# Altium project PCB-Tester-Board-V1.PrjPcb (part 2 of 3)

## Sheet ADC.SchDoc
size A4; DateDraw: Date Draw; DateChecked: Date Review; Workspace: Workspace; TitleTyp: Title-Typ; PageSetup: Record=PageOptions|CenterHorizontal=True|CenterVertical=True|PrintScale=0.97|XCorrection=1.00|YCorrection=1.00|PrintKind=0|BorderSize=5000000|LeftOffset=0|BottomOffset=0|Orientation=2|PaperLength=1000|PaperWidth=1000|Scale=100|PaperSource=7|PrintQuality=-3|MediaType=1|DitherType=10|PrintScaleMode=1|PaperKind=A4|PaperIndex=9
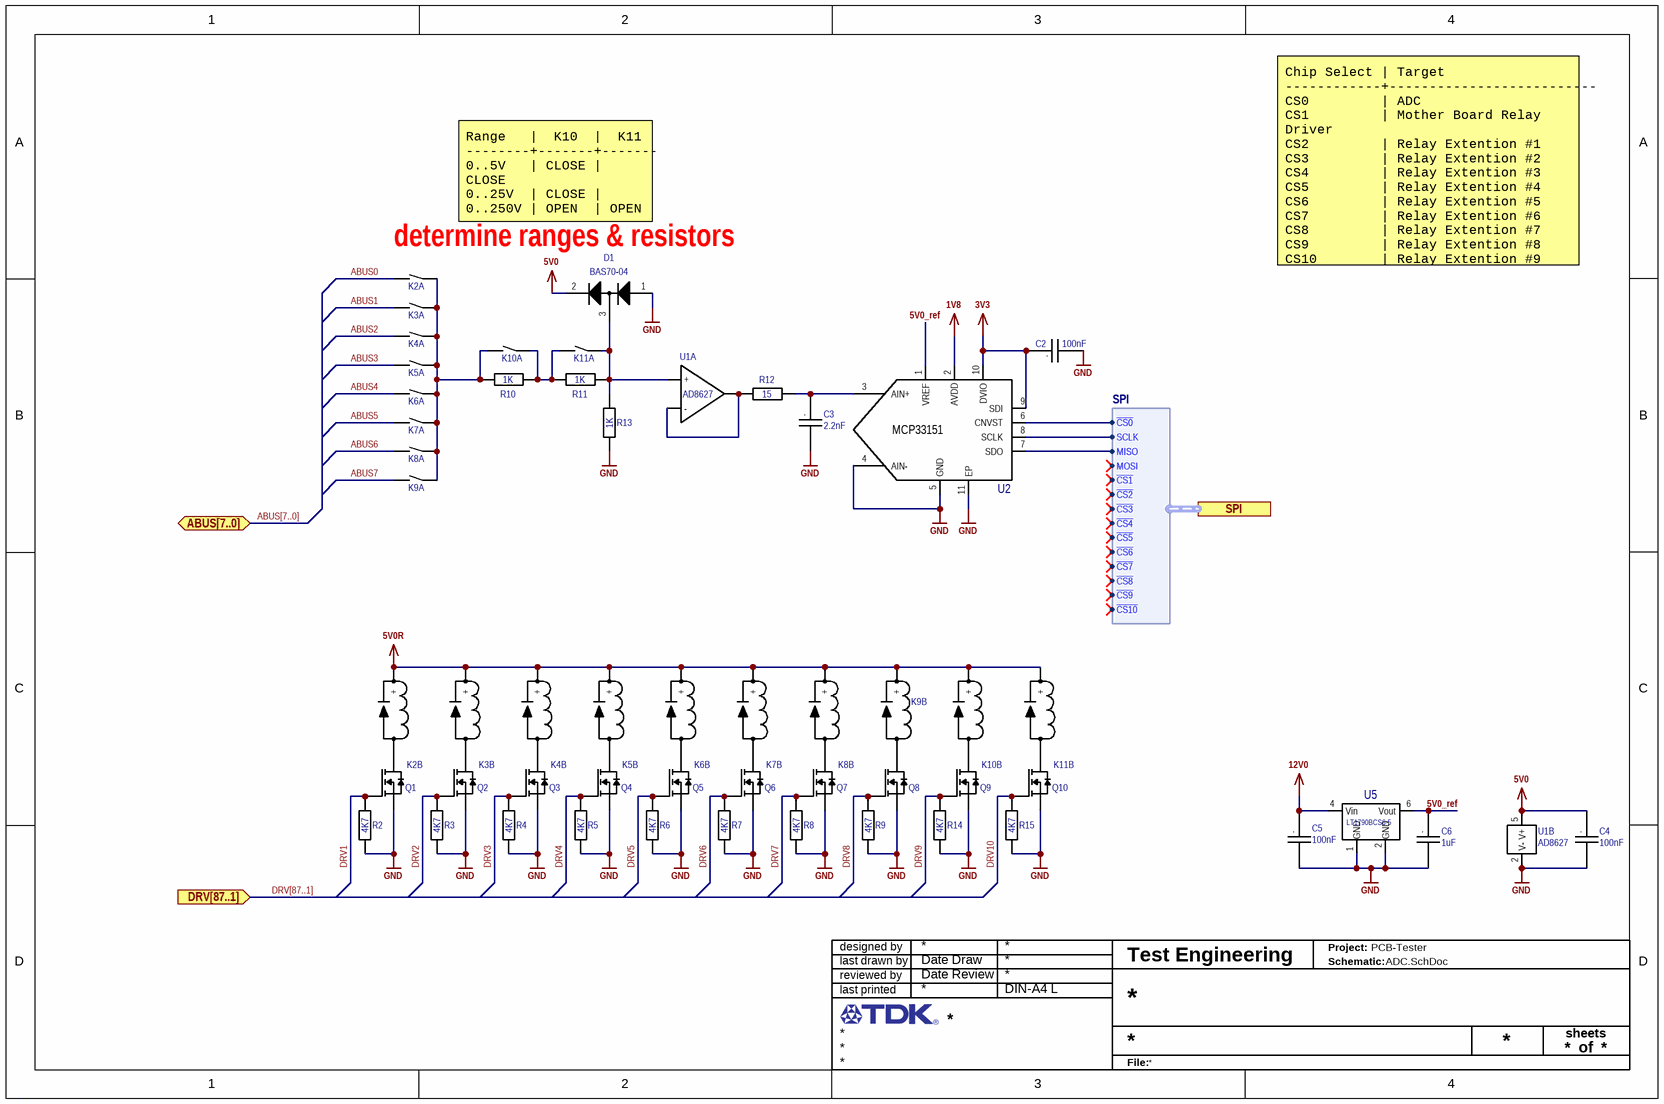
[diagram p5: ADC.SchDoc]

### Parts
C2  value 100nF  [C0402 Reflow]  (hidden comment: C)
C3  value 2.2nF  [C0402 Reflow]  (hidden comment: C)
C4  value 100nF  [C0402 Reflow]  (hidden comment: C)
C5  value 100nF  [C0402 Reflow]  (hidden comment: C)
C6  value 1uF  [C0402 Reflow]  (hidden comment: C)
D1  D  [SOT23-3]  (value not drawn)
K2  K  [118-1A]  (value not drawn)  (parts A,B of 2)
K3  K  [118-1A]  (value not drawn)  (parts A,B of 2)
K4  K  [118-1A]  (value not drawn)  (parts A,B of 2)
K5  K  [118-1A]  (value not drawn)  (parts A,B of 2)
K6  K  [118-1A]  (value not drawn)  (parts A,B of 2)
K7  K  [118-1A]  (value not drawn)  (parts A,B of 2)
K8  K  [118-1A]  (value not drawn)  (parts A,B of 2)
K9  K  [118-1A]  (value not drawn)  (parts A,B of 2)
K10  K  [118-1A]  (value not drawn)  (parts A,B of 2)
K11  K  [118-1A]  (value not drawn)  (parts A,B of 2)
Q1  Q  [SOT23-3]  (value not drawn)
Q2  Q  [SOT23-3]  (value not drawn)
Q3  Q  [SOT23-3]  (value not drawn)
Q4  Q  [SOT23-3]  (value not drawn)
Q5  Q  [SOT23-3]  (value not drawn)
Q6  Q  [SOT23-3]  (value not drawn)
Q7  Q  [SOT23-3]  (value not drawn)
Q8  Q  [SOT23-3]  (value not drawn)
Q9  Q  [SOT23-3]  (value not drawn)
Q10  Q  [SOT23-3]  (value not drawn)
R2  value 4K7  [R0402 Reflow]  (hidden comment: R)
R3  value 4K7  [R0402 Reflow]  (hidden comment: R)
R4  value 4K7  [R0402 Reflow]  (hidden comment: R)
R5  value 4K7  [R0402 Reflow]  (hidden comment: R)
R6  value 4K7  [R0402 Reflow]  (hidden comment: R)
R7  value 4K7  [R0402 Reflow]  (hidden comment: R)
R8  value 4K7  [R0402 Reflow]  (hidden comment: R)
R9  value 4K7  [R0402 Reflow]  (hidden comment: R)
R10  value 1K  [R0201 Reflow]  (hidden comment: R)
R11  value 1K  [R0201 Reflow]  (hidden comment: R)
R12  value 15  [R0402 Reflow]  (hidden comment: R)
R13  value 1K  [R0201 Reflow]  (hidden comment: R)
R14  value 4K7  [R0402 Reflow]  (hidden comment: R)
R15  value 4K7  [R0402 Reflow]  (hidden comment: R)
U1  U  [SC70-5]  (value not drawn)  (parts A,B of 2)
U2  NicName: MCP33151  [TDFN10EP]  (hidden comment: U)
U5  U  [TSOT23-6(S6)]  (value not drawn)

### Ports
ABUS[7..0] (bidir), DRV[87..1] (in), SPI (harness SPI)

### Harnesses
SPI: MISO, MOSI, SCLK, ~{CS0}, ~{CS1}, ~{CS2}, ~{CS3}, ~{CS4}, ~{CS5}, ~{CS6}, ~{CS7}, ~{CS8}, ~{CS9}, ~{CS10}

### Nets
1V8: U2.2(AVDD)
3V3: C2.1 U2.9(SDI) U2.10(DVIO)
5V0: C4.1 D1.2 U1.5(V+)
5V0R: K2.1(+) K3.1(+) K4.1(+) K5.1(+) K6.1(+) K7.1(+) K8.1(+) K9.1(+) K10.1(+) K11.1(+)
12V0: C5.1 U5.4(Vin)
GND: C2.2 C3.2 C4.2 C5.2 C6.2 D1.1 Q1.2(S) Q2.2(S) Q3.2(S) Q4.2(S) Q5.2(S) Q6.2(S) Q7.2(S) Q8.2(S) Q9.2(S) Q10.2(S) R2.1 R3.1 R4.1 R5.1 R6.1 R7.1 R8.1 R9.1 R13.1 R14.1 R15.1 U1.2(V-) U2.4(AIN-) U2.5(GND) U2.11(EP) U5.1(GND) U5.2(GND)
5V0_ref: C6.1 U2.1(VREF) U5.6(Vout)
~{CS0}: U2.6(CNVST) ; port SPI.~{CS0}
ABUS0: K2.3(CA)
ABUS1: K3.3(CA)
ABUS2: K4.3(CA)
ABUS3: K5.3(CA)
ABUS4: K6.3(CA)
ABUS5: K7.3(CA)
ABUS6: K8.3(CA)
ABUS7: K9.3(CA)
DRV1: Q1.1(G) R2.2
DRV2: Q2.1(G) R3.2
DRV3: Q3.1(G) R4.2
DRV4: Q4.1(G) R5.2
DRV5: Q5.1(G) R6.2
DRV6: Q6.1(G) R7.2
DRV7: Q7.1(G) R8.2
DRV8: Q8.1(G) R9.2
DRV9: Q9.1(G) R14.2
DRV10: Q10.1(G) R15.2
MISO: U2.7(SDO) ; port SPI.MISO
SCLK: U2.8(SCLK) ; port SPI.SCLK
NetC3_1: C3.1 R12.1 U2.3(AIN+)
NetD1_3: D1.3 K11.4(CB) R11.2 R13.2 U1.3(+)
NetK2_2: K2.2(-) Q1.3(D)
NetK2_4: K2.4(CB) K3.4(CB) K4.4(CB) K5.4(CB) K6.4(CB) K7.4(CB) K8.4(CB) K9.4(CB) K10.3(CA) R10.1
NetK3_2: K3.2(-) Q2.3(D)
NetK4_2: K4.2(-) Q3.3(D)
NetK5_2: K5.2(-) Q4.3(D)
NetK6_2: K6.2(-) Q5.3(D)
NetK7_2: K7.2(-) Q6.3(D)
NetK8_2: K8.2(-) Q7.3(D)
NetK9_2: K9.2(-) Q8.3(D)
NetK10_2: K10.2(-) Q9.3(D)
NetK10_4: K10.4(CB) K11.3(CA) R10.2 R11.1
NetK11_2: K11.2(-) Q10.3(D)
NetR12_2: R12.2 U1.1(Out) U1.4(-)

### Buses and harness runs
bus ABUS[7..0] = port ABUS[7..0]
bus DRV[87..1] = port DRV[87..1]

### Notes on the sheet
- determine ranges & resistors
- Range   |  K10  |  K11
  --------+-------+-------
  0..5V   | CLOSE | CLOSE
  0..25V  | CLOSE |
  0..250V | OPEN  | OPEN
- Chip Select | Target
  ------------+--------------------------
  CS0         | ADC
  CS1         | Mother Board Relay Driver
  CS2         | Relay Extention #1
  CS3         | Relay Extention #2
  CS4         | Relay Extention #3
  CS5         | Relay Extention #4
  CS6         | Relay Extention #5
  CS7         | Relay Extention #6
  CS8         | Relay Extention #7
  CS9         | Relay Extention #8
  CS10        | Relay Extention #9
- designed by
- reviewed by
- last drawn by
- Project:
- Schematic:
- last printed
- DIN-A4 L
- sheets
- of
- File:
- (in symbol C) .

### Library data of the parts
C2 C4 C5 = C: CAP CER 0.1UF 16V X7R 0402; 04. Manufacturer: KEMET; 07. Manufacturer  Part Number: C0402C104J4RACTU; Tolerance: ±5%; 03. Unit Price: 0.45; 13. Created Date/Name: AUG2018/Hören; Voltage Rating: 16V; Type: X7R; ComponentLink1Description: Info; ComponentLink1URL: https://www.digikey.de/product-detail/en/kemet/C0402C104J4RACTU/399-7761-6-ND/3472292; 02. Distributor Part Number: 399-7761-6-ND; 09. Operating Temperature: -55°C ~ 125°C; 11. RoHS: YES; 01. Distributor: DigiKey; ComponentLink2Description: DataSheet; ComponentLink2URL: https://content.kemet.com/datasheets/KEM_C1002_X7R_SMD.pdf; Package: 0402
C3 = C: CAP CER 2200PF 50V X7R 0402; 04. Manufacturer: Samsung Electro-Mechanics; 07. Manufacturer  Part Number: CL05B222JB5NNNC; Tolerance: ±5%; 03. Unit Price: 0.09; 13. Created Date/Name: AUG2018/Hören; Voltage Rating: 50V; Type: X7R; ComponentLink1Description: Info; ComponentLink1URL: https://www.digikey.de/product-detail/en/samsung-electro-mechanics/CL05B222JB5NNNC/1276-1532-6-ND/3892046; 02. Distributor Part Number: 1276-1532-6-ND; 09. Operating Temperature: -55°C ~ 125°C; 11. RoHS: YES; 01. Distributor: DigiKey; ComponentLink2Description: DataSheet; Package: 0402
C6 = C: CAP CER 1UF 6.3V X7R 0402; 04. Manufacturer: Murata Electronics; 07. Manufacturer  Part Number: GRM155R70J105KA12J; Tolerance: ±10%; 03. Unit Price: 0.11; 13. Created Date/Name: AUG2018/Hören; Voltage Rating: 6.3V; Type: X7R; ComponentLink1Description: Info; ComponentLink1URL: https://www.digikey.de/product-detail/en/murata-electronics/GRM155R70J105KA12J/490-13339-6-ND/5973468; 02. Distributor Part Number: 490-13339-6-ND; 09. Operating Temperature: -55°C ~ 125°C; 11. RoHS: YES; 01. Distributor: DigiKey; ComponentLink2Description: DataSheet; Package: 0402
D1 = BAS70-04: DIODE ARRAY SCHOTTKY 70V SOT23-3; 04. Manufacturer: DIODES Inc; 03. Unit Price: 0.22; 05. Quantity: 1; 13. Created Date/Name: AUG 2018 / Hören; ComponentLink1Description: Info; ComponentLink1URL: https://www.digikey.de/products/en?keywords=BAS70-04-FDITR-ND; 01. Distributor: DigiKey; 02. Distributor Part Number: BAS70-04-FDITR-ND; 09. Operating Temperature: -55°C ~ 125°C; 11. RoHS: YES; ComponentLink4Description: DataSheet; ComponentLink4URL: https://www.diodes.com/assets/Datasheets/ds11007.pdf; 07. Manufacturer  Part Number: BAS70-04
K2-K11 = 118-1-A-5/2D: 5V Signal Relais, Normal Open; 04. Manufacturer: Pickering; 03. Unit Price: 2.60; 05. Quantity: 1000; 06. Data Sheet: Pickering_series_118.pdf; 13. Created Date/Name: 20.12.17 S. Kaiser; Coil Resistance: 1500 Ohm; Max Carry Current: 1.2 A; Max Switch Current: 1A; Max Switch Voltage: 200V; Power Rating: 15W; 01. Distributor: Pickering; 02. Distributor Part Number: 118-1-A-5/2D; 07. Manufacturer  Part Number: 118-1-A-5/2D; 09. Operating Temperature: -20°C ~ +85°C; 11. RoHS: 2011/65/EU; ComponentLink1Description: Info; ComponentLink1URL: http://www.pickeringrelay.com/; ComponentLink2Description: DataSheet; ComponentLink2URL: https://www.pickeringrelay.com/products/single-line-sil-series-111-119/single-line-sil-series-118/; Coil Voltage: 5V
Q1-Q10 = FDV303N: as Q77 on sheet Instrument; 01. Distributor: DigiKey; 02. Distributor Part Number: FDV303NDKR-ND; 07. Manufacturer  Part Number: FDV303N; 09. Operating Temperature: -55°C ~ 150°C (TJ); 11. RoHS: YES; ComponentLink1Description: Info; ComponentLink1URL: https://www.digikey.de/product-detail/en/on-semiconductor/FDV303N/FDV303NDKR-ND/1630434; ComponentLink2Description: DataSheet; ComponentLink2URL: https://media.digikey.com/pdf/Data%20Sheets/Fairchild%20PDFs/FDV303N.pdf; Vdss: 25V; Id: 680mA
R2-R11 R13-R15 = R: as R1 on sheet Instrument; ComponentLink1URL: *; ComponentLink1Description: Info; 09. Operating Temperature: -xx..+yy°C; 11. RoHS: ???; ComponentLink2Description: DataSheet; Package: *
R12 = R: RES SMD 15 OHM 1% 1/10W 0402; 04. Manufacturer: Panasonic Electronic Components; 07. Manufacturer  Part Number: ERJ-2RKF15R0X; 03. Unit Price: 0.09; 13. Created Date/Name: AUG2018/Hören; Power Rating: 0.1W; Tolerance: ±1%; ComponentLink1URL: https://www.digikey.de/product-detail/en/panasonic-electronic-components/ERJ-2RKF15R0X/P15.0LDKR-ND/575530; ComponentLink1Description: Info; 02. Distributor Part Number: P15.0LDKR-ND; 09. Operating Temperature: -55°C ~ 155°C; 11. RoHS: YES; 01. Distributor: DigiKey; ComponentLink2Description: DataSheet; ComponentLink2URL: https://industrial.panasonic.com/cdbs/www-data/pdf/RDA0000/AOA0000C304.pdf; Type: Thick Film; Package: 0402
U1 = AD8627: IC OPAMP JFET 5MHZ RRO SC70-5; 04. Manufacturer: Analog Devices Inc.; 07. Manufacturer  Part Number: AD8627AKSZ-R2; 03. Unit Price: 5.15; 13. Created Date/Name: AUG 2018 / Hören; 01. Distributor: DigiKey; 02. Distributor Part Number: AD8627AKSZ-R2DKR-ND; 09. Operating Temperature: -40°C ~ 85°C; 11. RoHS: YES; ComponentLink1Description: Info; ComponentLink1URL: https://www.digikey.de/product-detail/en/analog-devices-inc/AD8627AKSZ-R2/AD8627AKSZ-R2DKR-ND/3878640; ComponentLink2Description: DataSheet; ComponentLink2URL: http://www.analog.com/media/en/technical-documentation/data-sheets/AD8625_8626_8627.pdf; Package: SC70-5; Part: AD8627
U2 = MCP33151-10T-E/MN: 14-BIT 1 MSPS SGL CH SGL-ENDED S; 04. Manufacturer: Microchip Technology; 03. Unit Price: 4.5; 13. Created Date/Name: AUG 2018 / Hören; 01. Distributor: DigiKey; 02. Distributor Part Number: MCP33151-10T-E/MNDKR-ND; 07. Manufacturer  Part Number: MCP33151-10T-E/MN; 11. RoHS: YES; ComponentLink1Description: Info; ComponentLink1URL: https://www.digikey.de/product-detail/en/microchip-technology/MCP33151-10T-E-MN/MCP33151-10T-E-MNDKR-ND/10270414; ComponentLink2Description: DataSheet; ComponentLink2URL: http://ww1.microchip.com/downloads/en/DeviceDoc/MCP33151-XX-Family-Data-Sheet-DS20006220A.pdf; Package: 10-WFDFN Exposed Pad
U5 = LT1790BCS6-5: IC VREF SERIES 5V, 0.1% TSOT-23-6; 04. Manufacturer: Linear Technology/Analog Devices; 07. Manufacturer  Part Number: LT1790BCS6-5#TRMPBF; 03. Unit Price: 2.86; 13. Created Date/Name: AUG 2018 / Hören; 01. Distributor: DigiKey; 02. Distributor Part Number: LT1790BCS6-5#TRMPBFDKR-ND; 09. Operating Temperature: 0°C ~ 70°C (TA); 11. RoHS: YES; ComponentLink1Description: Info; ComponentLink1URL: https://www.digikey.de/product-detail/en/linear-technology-analog-devices/LT1790BCS6-5-TRMPBF/LT1790BCS6-5-TRMPBFDKR-ND/1618066; ComponentLink2Description: DataSheet; ComponentLink2URL: https://www.analog.com/media/en/technical-documentation/data-sheets/1790fc.pdf; NicName: LT1790BCS6-5

## Sheet RelayDriver.SchDoc
size A4 portrait; DateDraw: Date Draw; DateChecked: Date Review; Workspace: Workspace; TitleTyp: Title-Typ; PageSetup: Record=PageOptions|CenterHorizontal=True|CenterVertical=True|PrintScale=0.97|XCorrection=1.00|YCorrection=1.00|PrintKind=0|BorderSize=5000000|LeftOffset=0|BottomOffset=0|Orientation=2|PaperLength=1000|PaperWidth=1000|Scale=100|PaperSource=7|PrintQuality=-3|MediaType=1|DitherType=10|PrintScaleMode=1|PaperKind=A4|PaperIndex=9
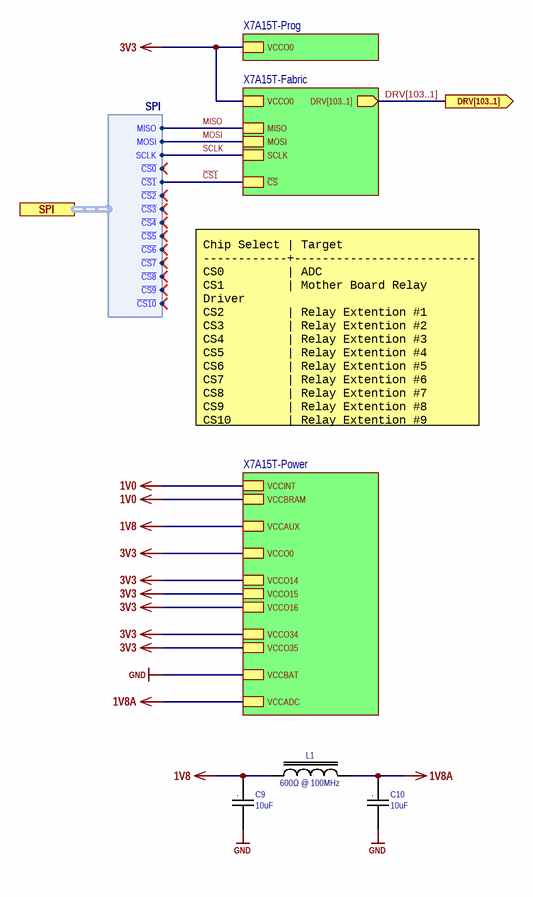
[diagram p6: RelayDriver.SchDoc]

### Parts
C9  value 10uF  [C0805 Reflow]  (hidden comment: C)
C10  value 10uF  [C0805 Reflow]  (hidden comment: C)
L1  Nominal Impedance: 600Ω @ 100MHz  [FB0805]  (hidden comment: L)

### Sub-sheets
X7A15T-Fabric = X7A15T-Fabric.SchDoc: SCLK, MISO, VCCO0, MOSI, ~{CS}, DRV[103..1] (out)
X7A15T-Power = X7A15T-Power.SchDoc (file not in this document): VCCADC, VCCO0, VCCO14, VCCO35, VCCO16, VCCAUX, VCCINT, VCCO34, VCCBRAM, VCCO15, VCCBAT
X7A15T-Prog = X7A15T-Prog.SchDoc: VCCO0

### Ports
DRV[103..1] (out), SPI (harness SPI)

### Harnesses
SPI: MISO, MOSI, SCLK, ~{CS0}, ~{CS1}, ~{CS2}, ~{CS3}, ~{CS4}, ~{CS5}, ~{CS6}, ~{CS7}, ~{CS8}, ~{CS9}, ~{CS10}

### Nets
1V0: sheet X7A15T-Power/VCCINT, sheet X7A15T-Power/VCCBRAM
1V8: C9.1 L1.1 ; sheet X7A15T-Power/VCCAUX
1V8A: C10.1 L1.2 ; sheet X7A15T-Power/VCCADC
3V3: sheet X7A15T-Prog/VCCO0, sheet X7A15T-Fabric/VCCO0, sheet X7A15T-Power/VCCO0, sheet X7A15T-Power/VCCO14, sheet X7A15T-Power/VCCO35, sheet X7A15T-Power/VCCO16, sheet X7A15T-Power/VCCO34, sheet X7A15T-Power/VCCO15
GND: C9.2 C10.2 ; sheet X7A15T-Power/VCCBAT
~{CS1}: sheet X7A15T-Fabric/~{CS}, port SPI.~{CS1}
MISO: sheet X7A15T-Fabric/MISO, port SPI.MISO
MOSI: sheet X7A15T-Fabric/MOSI, port SPI.MOSI
SCLK: sheet X7A15T-Fabric/SCLK, port SPI.SCLK

### Buses and harness runs
bus DRV[103..1] = port DRV[103..1] = sheet X7A15T-Fabric/DRV[103..1]

### Notes on the sheet
- Chip Select | Target
  ------------+--------------------------
  CS0         | ADC
  CS1         | Mother Board Relay Driver
  CS2         | Relay Extention #1
  CS3         | Relay Extention #2
  CS4         | Relay Extention #3
  CS5         | Relay Extention #4
  CS6         | Relay Extention #5
  CS7         | Relay Extention #6
  CS8         | Relay Extention #7
  CS9         | Relay Extention #8
  CS10        | Relay Extention #9
- designed by
- reviewed by
- last drawn by
- Project:
- Schematic:
- last printed
- DIN-A4 P
- sheets
- of
- File:
- (in symbol C) .

### Library data of the parts
C9 C10 = C: CAP CER 10UF 10V X7R 0805; 04. Manufacturer: Samsung Electro-Mechanics; 07. Manufacturer  Part Number: CL21B106KPQNNNE; Tolerance: ±10%; 03. Unit Price: 0.24; 13. Created Date/Name: AUG2018/Hören; Voltage Rating: 10V; Type: X7R; ComponentLink1Description: Info; ComponentLink1URL: https://www.digikey.de/products/en?keywords=1276-1764-6-ND; 02. Distributor Part Number: 1276-1764-6-ND; 09. Operating Temperature: -55°C ~ 125°C; 11. RoHS: YES; 01. Distributor: DigiKey; ComponentLink2Description: DataSheet; Package: 0805
L1 = FB: FERRITE BEAD 600 OHM 0805 1LN; 04. Manufacturer: Würth Elektronik; 07. Manufacturer  Part Number: 742792040; DCR: 150mΩ; Impedance Tolerance: %; 03. Unit Price: 0.22; 13. Created Date/Name: AUG2018/Hören; IRMS: 2A; ComponentLink1Description: Info; ComponentLink1URL: https://www.digikey.de/products/en?keywords=732-1620-6-ND; ComponentLink2Description: DataSheet; ComponentLink2URL: https://www.we-online.de/katalog/datasheet/742792040.pdf; 02. Distributor Part Number: 732-1620-6-ND; 09. Operating Temperature: -55°C ~ 125°C; 11. RoHS: YES; 01. Distributor: DigiKey; ISAT: *; Package: 0805; Tolerance: *; Value: *

## Sheet X7A15T-Prog.SchDoc: =Board +' X7A15T-FPGA1'
size A4; Organization: Test Engineering; Address1: Hans-Bunte-Strasse 19; Address2: D-79108 Freiburg; Address3: Germany; DocumentNumber: U33xxx-S; Revision: V1.0; SheetNumber: 71; SheetTotal: 80; Date: OCT 2018; CheckedBy: ALL; Author: Moerz; CompanyName: TDK-Micronas GmbH; DrawnBy: Moerz; Engineer: Moerz; DateDraw: OCT 2018; DateChecked: N/A; PageSetup: Record=PageOptions|CenterHorizontal=True|CenterVertical=True|PrintScale=0.97|XCorrection=1.00|YCorrection=1.00|PrintKind=0|BorderSize=5000000|LeftOffset=0|BottomOffset=0|Orientation=2|PaperLength=1000|PaperWidth=1000|Scale=100|PaperSource=7|PrintQuality=-3|MediaType=1|DitherType=10|PrintScaleMode=1|PaperKind=A4|PaperIndex=9; TitleTyp: Title-Typ; Block: CPU & SCT8; Workspace: Workspace
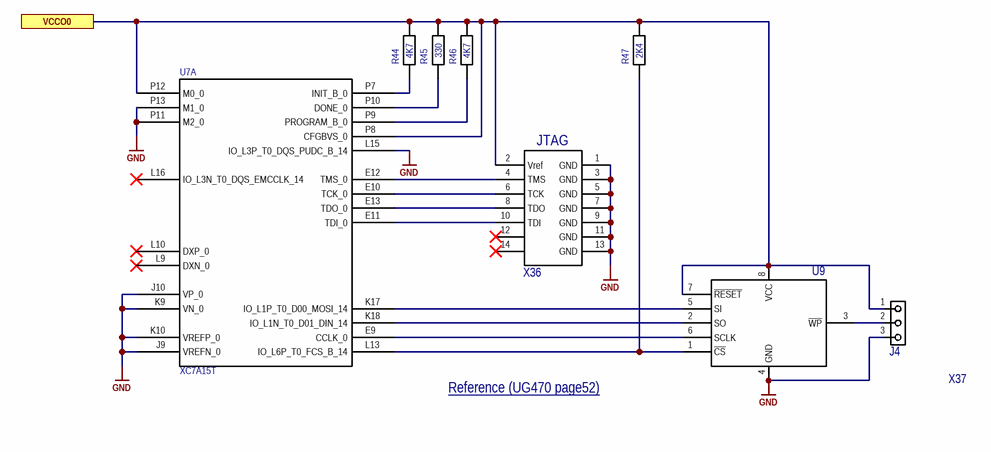
[diagram p7: X7A15T-Prog.SchDoc]

### Parts
J4  J  [Header 100mil 3x1]  (value not drawn)
R44  value 4K7  [R0402 Reflow]  (hidden comment: R)
R45  value 330  [R0402 Reflow]  (hidden comment: R)
R46  value 4K7  [R0402 Reflow]  (hidden comment: R)
R47  value 2K4  [R0402 Reflow]  (hidden comment: R)
U7  NicName: XC7A15T  [XC7A15T-1CSG324C]  (hidden comment: U)  (part A of 8)
U9  U  [SOIC8 (R-8)]  (value not drawn)
X36  NickName: JTAG  [LTMM-107-02-F-D]  (hidden comment: X)
X37  X  (value not drawn)

### Ports
VCCO0

### Nets
3V3: J4.1 R44.2 R45.2 R46.2 R47.2 U7.P8(CFGBVS_0) U7.P12(M0_0) U9.7(~{RESET}) U9.8(VCC) X36.2(Vref) ; port VCCO0
GND: J4.3 U7.J9(VREFN_0) U7.J10(VP_0) U7.K9(VN_0) U7.K10(VREFP_0) U7.L15(IO_L3P_T0_DQS_PUDC_B_14) U7.P11(M2_0) U7.P13(M1_0) U9.4(GND) X36.1(GND) X36.3(GND) X36.5(GND) X36.7(GND) X36.9(GND) X36.11(GND) X36.13(GND)
NetJ4_2: J4.2 U9.3(~{WP})
NetR44_1: R44.1 U7.P7(INIT_B_0)
NetR45_1: R45.1 U7.P10(DONE_0)
NetR46_1: R46.1 U7.P9(PROGRAM_B_0)
NetR47_1: R47.1 U7.L13(IO_L6P_T0_FCS_B_14) U9.1(~{CS})
NetU7_E9: U7.E9(CCLK_0) U9.6(SCLK)
NetU7_E10: U7.E10(TCK_0) X36.6(TCK)
NetU7_E11: U7.E11(TDI_0) X36.10(TDI)
NetU7_E12: U7.E12(TMS_0) X36.4(TMS)
NetU7_E13: U7.E13(TDO_0) X36.8(TDO)
NetU7_K17: U7.K17(IO_L1P_T0_D00_MOSI_14) U9.5(SI)
NetU7_K18: U7.K18(IO_L1N_T0_D01_DIN_14) U9.2(SO)

Not connected (* = marked no-connect by the designer): U7 L9(DXN_0)* L10(DXP_0)* L16(IO_L3N_T0_DQS_EMCCLK_14)*; X36 12* 14*

### Notes on the sheet
- Reference (UG470 page52) <https://www.xilinx.com/support/documentation/user_guides/ug470_7Series_Config.pdf>
- designed by
- reviewed by
- last drawn by
- Project:
- Schematic:
- last printed
- DIN-A4 L
- sheets
- of
- File:

### Library data of the parts
J4 = Header 3Pins 100mil: as J1 on sheet Controller; 01. Distributor: Samtec Inc.; 02. Distributor Part Number: HMTSW-103-07-G-S-240; 11. RoHS: YES; ComponentLink1Description: Info; ComponentLink1URL: https://www.samtec.com/products/hmtsw-103-07-g-s-240; ComponentLink2Description: DataSheet; ComponentLink2URL: http://suddendocs.samtec.com/catalog_english/hmtsw.pdf
R44 R46 = R: RES SMD 4.7K OHM 1% 1/16W 0402; 04. Manufacturer: Yageo; 07. Manufacturer  Part Number: RC0402FR-074K7L; 03. Unit Price: 0.09; 13. Created Date/Name: AUG2018/Hören; Power Rating: 63mW; Tolerance: ±1%; ComponentLink1URL: https://www.digikey.de/products/en?keywords=311-4.7KLRDKR-ND; ComponentLink1Description: Info; 02. Distributor Part Number: 311-4.7KLRDKR-ND; 09. Operating Temperature: -55°C ~ 155°C; 11. RoHS: YES; 01. Distributor: DigiKey; ComponentLink2Description: DataSheet; Type: Thick Film; Package: 0402
R45 = R: RES SMD 330 OHM 1% 1/16W 0402; 04. Manufacturer: Yageo; 07. Manufacturer  Part Number: RC0402FR-07330RL; 03. Unit Price: 0.09; 13. Created Date/Name: AUG2018/Hören; Power Rating: 63mW; Tolerance: ±1%; ComponentLink1URL: https://www.digikey.de/products/en?keywords=311-330LRDKR-ND; ComponentLink1Description: Info; 02. Distributor Part Number: 311-330LRDKR-ND; 09. Operating Temperature: -55°C ~ 155°C; 11. RoHS: YES; 01. Distributor: DigiKey; ComponentLink2Description: DataSheet; Type: Thick Film; Package: 0402
R47 = R: RES SMD 2.4K OHM 1% 1/16W 0402; 04. Manufacturer: Yageo; 07. Manufacturer  Part Number: RC0402FR-072K4L; 03. Unit Price: 0.09; 13. Created Date/Name: AUG2018/Hören; Power Rating: 63mW; Tolerance: ±1%; ComponentLink1URL: *; ComponentLink1Description: Info; 02. Distributor Part Number: 311-2.40KLRDKR-ND; 09. Operating Temperature: -55°C ~ 155°C; 11. RoHS: YES; 01. Distributor: DigiKey; ComponentLink2Description: DataSheet; Type: Thick Film; Package: 0402
U7 = XC7A15T-CS324: XC7A15T-1CSG324C; MFR: XILINX; POPULATED: yes; 03. Unit Price: 20.65; MFR-PN: XC7A15T-CS324; 04. Manufacturer: XILINX; 07. Manufacturer  Part Number: XC7A15T-1CSG324C; 01. Distributor: Avnet; 02. Distributor Part Number: XC7A15T-1CSG324C; 09. Operating Temperature: 0°C ~ 85°C (TJ); 11. RoHS: YES; ComponentLink4Description: Info; ComponentLink4URL: https://www.digikey.de/products/en?keywords=XC7A15T-1CSG324C; ComponentLink5Description: DataSheet; ComponentLink5URL: https://www.xilinx.com/support/documentation/data_sheets/ds181_Artix_7_Data_Sheet.pdf; ComponentLink6Description: NXP; ComponentLink6URL: https://www.nxp.com/part/MK20DN512VMD10
U9 = MX25R3235FM1IH0: IC FLASH 32M SPI 80MHZ 8SOP; 13. Created Date/Name: AUG 2018 / Hören; ComponentLink1Description: Info; ComponentLink1URL: https://www.digikey.de/product-detail/en/macronix/MX25R3235FM1IH0/1092-1175-ND/5957736; ComponentLink2Description: DataSheet; ComponentLink2URL: https://www.macronix.com/Lists/Datasheet/Attachments/7534/MX25R3235F%2c%20Wide%20Range%2c%2032Mb%2c%20v1.6.pdf
X36 = LTMM-107-02-F-D: CONN HEADER VERT 14POS 2MM; 04. Manufacturer: Samtec Inc.; 03. Unit Price: 2.38; 13. Created Date/Name: ??? / Hören; System: Connector; 01. Distributor: DigiKey; 02. Distributor Part Number: LTMM-107-02-F-D-ND; 07. Manufacturer  Part Number: LTMM-107-02-F-D; 11. RoHS: YES; ComponentLink1Description: Info; ComponentLink1URL: https://www.digikey.de/product-detail/en/samtec-inc/LTMM-107-02-F-D/LTMM-107-02-F-D-ND/8723899; ComponentLink2Description: DataSheet; ComponentLink2URL: https://www.samtec.com/products/ltmm
X37 = Jumper: CONN JUMPER SHORTING .100" GOLD; 04. Manufacturer: Sullins Connector Solutions; 07. Manufacturer  Part Number: QPC02SXGN-RC; 03. Unit Price: 0.09; 13. Created Date/Name: AUG2018/Hören; 01. Distributor: DigiKey; 02. Distributor Part Number: S9337-ND; 09. Operating Temperature: -xx..+yy°C; 11. RoHS: ???; ComponentLink1Description: Info; ComponentLink1URL: https://www.digikey.de/product-detail/en/sullins-connector-solutions/QPC02SXGN-RC/S9337-ND/2618262; ComponentLink2Description: DataSheet

## Sheet X7A15T-Fabric.SchDoc: =Board +' X7A15T-FPGA2'
size A3; Organization: Test Engineering; Address1: Hans-Bunte-Strasse 19; Address2: D-79108 Freiburg; Address3: Germany; DocumentNumber: U33xxx-S; Revision: V1.0; SheetNumber: 72; SheetTotal: 80; Date: OCT 2018; CheckedBy: ALL; Author: Moerz; CompanyName: TDK-Micronas GmbH; DrawnBy: Moerz; Engineer: Moerz; DateDraw: OCT 2018; DateChecked: N/A; PageSetup: Record=PageOptions|CenterHorizontal=True|CenterVertical=True|PrintScale=0.97|XCorrection=1.00|YCorrection=1.00|PrintKind=0|BorderSize=5000000|LeftOffset=0|BottomOffset=0|Orientation=2|PaperLength=1000|PaperWidth=1000|Scale=100|PaperSource=7|PrintQuality=-3|MediaType=1|DitherType=10|PrintScaleMode=1|PaperKind=A4|PaperIndex=9; TitleTyp: Title-Typ; Block: CPU & SCT8; Workspace: Workspace
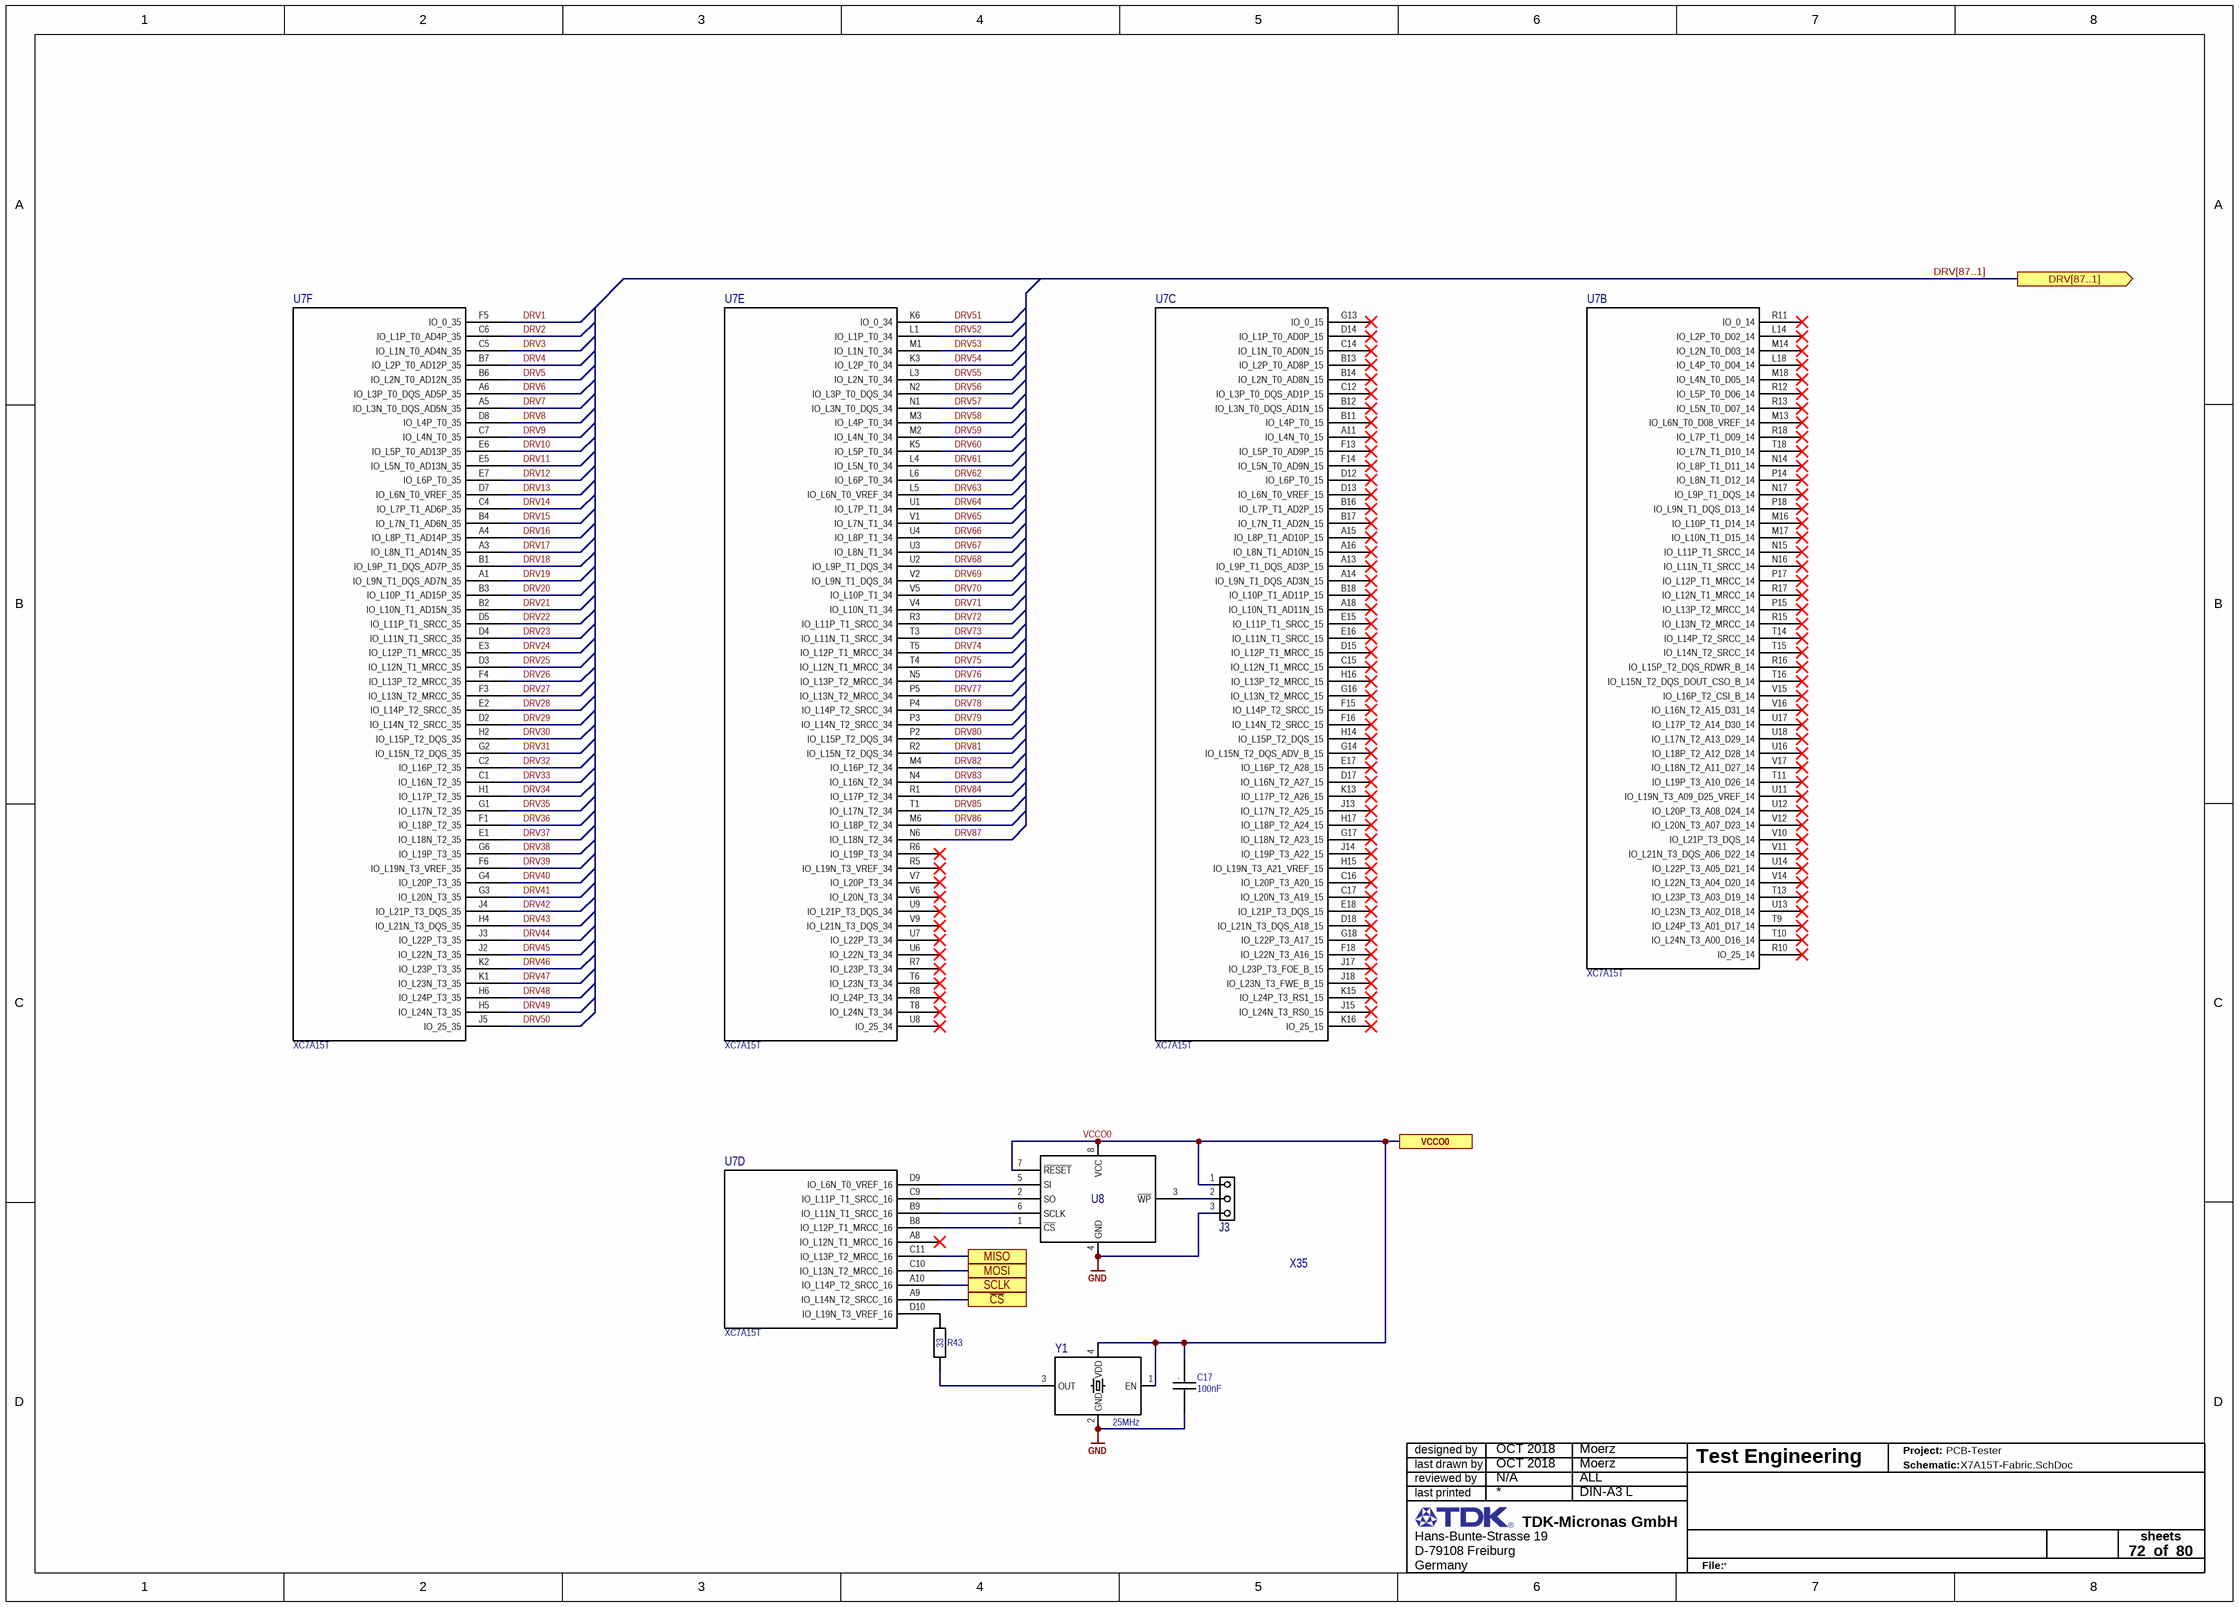
[diagram p8: X7A15T-Fabric.SchDoc]

### Parts
C17  value 100nF  [C0402 Reflow]  (hidden comment: C)
J3  J  [Header 100mil 3x1]  (value not drawn)
R43  value 33  [R0402 Reflow]  (hidden comment: R)
U7  NicName: XC7A15T  [XC7A15T-1CSG324C]  (hidden comment: U)  (parts B,C,D,E,F of 8)
U8  U  [SOIC8 (R-8)]  (value not drawn)
X35  X  (value not drawn)
Y1  Frequency: 25MHz  [4SMD]  (hidden comment: Y)

### Ports
DRV[87..1] (out), MISO, MOSI, SCLK, VCCO0, ~{CS}

### Nets
GND: C17.2 J3.3 U8.4(GND) Y1.2(GND)
VCCO0: C17.1 J3.1 U8.7(~{RESET}) U8.8(VCC) Y1.1(EN) Y1.4(VDD) ; port VCCO0  [project net 3V3]
~{CS1}: U7.A9(IO_L14N_T2_SRCC_16) ; port ~{CS}
DRV1: U7.F5(IO_0_35)  [project net DRV1_72]
DRV2: U7.C6(IO_L1P_T0_AD4P_35)  [project net DRV2_72]
DRV3: U7.C5(IO_L1N_T0_AD4N_35)  [project net DRV3_72]
DRV4: U7.B7(IO_L2P_T0_AD12P_35)  [project net DRV4_72]
DRV5: U7.B6(IO_L2N_T0_AD12N_35)  [project net DRV5_72]
DRV6: U7.A6(IO_L3P_T0_DQS_AD5P_35)  [project net DRV6_72]
DRV7: U7.A5(IO_L3N_T0_DQS_AD5N_35)  [project net DRV7_72]
DRV8: U7.D8(IO_L4P_T0_35)  [project net DRV8_72]
DRV9: U7.C7(IO_L4N_T0_35)  [project net DRV9_72]
DRV10: U7.E6(IO_L5P_T0_AD13P_35)  [project net DRV10_72]
DRV11: U7.E5(IO_L5N_T0_AD13N_35)  [project net DRV11_72]
DRV12: U7.E7(IO_L6P_T0_35)  [project net DRV12_72]
DRV13: U7.D7(IO_L6N_T0_VREF_35)  [project net DRV13_72]
DRV14: U7.C4(IO_L7P_T1_AD6P_35)  [project net DRV14_72]
DRV15: U7.B4(IO_L7N_T1_AD6N_35)  [project net DRV15_72]
DRV16: U7.A4(IO_L8P_T1_AD14P_35)  [project net DRV16_72]
DRV17: U7.A3(IO_L8N_T1_AD14N_35)  [project net DRV17_72]
DRV18: U7.B1(IO_L9P_T1_DQS_AD7P_35)  [project net DRV18_72]
DRV19: U7.A1(IO_L9N_T1_DQS_AD7N_35)  [project net DRV19_72]
DRV20: U7.B3(IO_L10P_T1_AD15P_35)  [project net DRV20_72]
DRV21: U7.B2(IO_L10N_T1_AD15N_35)  [project net DRV21_72]
DRV22: U7.D5(IO_L11P_T1_SRCC_35)  [project net DRV22_72]
DRV23: U7.D4(IO_L11N_T1_SRCC_35)  [project net DRV23_72]
DRV24: U7.E3(IO_L12P_T1_MRCC_35)  [project net DRV24_72]
DRV25: U7.D3(IO_L12N_T1_MRCC_35)  [project net DRV25_72]
DRV26: U7.F4(IO_L13P_T2_MRCC_35)  [project net DRV26_72]
DRV27: U7.F3(IO_L13N_T2_MRCC_35)  [project net DRV27_72]
DRV28: U7.E2(IO_L14P_T2_SRCC_35)  [project net DRV28_72]
DRV29: U7.D2(IO_L14N_T2_SRCC_35)  [project net DRV29_72]
DRV30: U7.H2(IO_L15P_T2_DQS_35)  [project net DRV30_72]
DRV31: U7.G2(IO_L15N_T2_DQS_35)  [project net DRV31_72]
DRV32: U7.C2(IO_L16P_T2_35)  [project net DRV32_72]
DRV33: U7.C1(IO_L16N_T2_35)  [project net DRV33_72]
DRV34: U7.H1(IO_L17P_T2_35)  [project net DRV34_72]
DRV35: U7.G1(IO_L17N_T2_35)  [project net DRV35_72]
DRV36: U7.F1(IO_L18P_T2_35)  [project net DRV36_72]
DRV37: U7.E1(IO_L18N_T2_35)  [project net DRV37_72]
DRV38: U7.G6(IO_L19P_T3_35)  [project net DRV38_72]
DRV39: U7.F6(IO_L19N_T3_VREF_35)  [project net DRV39_72]
DRV40: U7.G4(IO_L20P_T3_35)  [project net DRV40_72]
DRV41: U7.G3(IO_L20N_T3_35)  [project net DRV41_72]
DRV42: U7.J4(IO_L21P_T3_DQS_35)  [project net DRV42_72]
DRV43: U7.H4(IO_L21N_T3_DQS_35)  [project net DRV43_72]
DRV44: U7.J3(IO_L22P_T3_35)  [project net DRV44_72]
DRV45: U7.J2(IO_L22N_T3_35)  [project net DRV45_72]
DRV46: U7.K2(IO_L23P_T3_35)  [project net DRV46_72]
DRV47: U7.K1(IO_L23N_T3_35)  [project net DRV47_72]
DRV48: U7.H6(IO_L24P_T3_35)  [project net DRV48_72]
DRV49: U7.H5(IO_L24N_T3_35)  [project net DRV49_72]
DRV50: U7.J5(IO_25_35)  [project net DRV50_72]
DRV51: U7.K6(IO_0_34)  [project net DRV51_72]
DRV52: U7.L1(IO_L1P_T0_34)  [project net DRV52_72]
DRV53: U7.M1(IO_L1N_T0_34)  [project net DRV53_72]
DRV54: U7.K3(IO_L2P_T0_34)  [project net DRV54_72]
DRV55: U7.L3(IO_L2N_T0_34)  [project net DRV55_72]
DRV56: U7.N2(IO_L3P_T0_DQS_34)  [project net DRV56_72]
DRV57: U7.N1(IO_L3N_T0_DQS_34)  [project net DRV57_72]
DRV58: U7.M3(IO_L4P_T0_34)  [project net DRV58_72]
DRV59: U7.M2(IO_L4N_T0_34)  [project net DRV59_72]
DRV60: U7.K5(IO_L5P_T0_34)  [project net DRV60_72]
DRV61: U7.L4(IO_L5N_T0_34)  [project net DRV61_72]
DRV62: U7.L6(IO_L6P_T0_34)  [project net DRV62_72]
DRV63: U7.L5(IO_L6N_T0_VREF_34)  [project net DRV63_72]
DRV64: U7.U1(IO_L7P_T1_34)  [project net DRV64_72]
DRV65: U7.V1(IO_L7N_T1_34)  [project net DRV65_72]
DRV66: U7.U4(IO_L8P_T1_34)  [project net DRV66_72]
DRV67: U7.U3(IO_L8N_T1_34)  [project net DRV67_72]
DRV68: U7.U2(IO_L9P_T1_DQS_34)  [project net DRV68_72]
DRV69: U7.V2(IO_L9N_T1_DQS_34)  [project net DRV69_72]
DRV70: U7.V5(IO_L10P_T1_34)  [project net DRV70_72]
DRV71: U7.V4(IO_L10N_T1_34)  [project net DRV71_72]
DRV72: U7.R3(IO_L11P_T1_SRCC_34)  [project net DRV72_72]
DRV73: U7.T3(IO_L11N_T1_SRCC_34)  [project net DRV73_72]
DRV74: U7.T5(IO_L12P_T1_MRCC_34)  [project net DRV74_72]
DRV75: U7.T4(IO_L12N_T1_MRCC_34)  [project net DRV75_72]
DRV76: U7.N5(IO_L13P_T2_MRCC_34)  [project net DRV76_72]
DRV77: U7.P5(IO_L13N_T2_MRCC_34)  [project net DRV77_72]
DRV78: U7.P4(IO_L14P_T2_SRCC_34)  [project net DRV78_72]
DRV79: U7.P3(IO_L14N_T2_SRCC_34)  [project net DRV79_72]
DRV80: U7.P2(IO_L15P_T2_DQS_34)  [project net DRV80_72]
DRV81: U7.R2(IO_L15N_T2_DQS_34)  [project net DRV81_72]
DRV82: U7.M4(IO_L16P_T2_34)  [project net DRV82_72]
DRV83: U7.N4(IO_L16N_T2_34)  [project net DRV83_72]
DRV84: U7.R1(IO_L17P_T2_34)  [project net DRV84_72]
DRV85: U7.T1(IO_L17N_T2_34)  [project net DRV85_72]
DRV86: U7.M6(IO_L18P_T2_34)  [project net DRV86_72]
DRV87: U7.N6(IO_L18N_T2_34)  [project net DRV87_72]
MISO: U7.C11(IO_L13P_T2_MRCC_16) ; port MISO
MOSI: U7.C10(IO_L13N_T2_MRCC_16) ; port MOSI
SCLK: U7.A10(IO_L14P_T2_SRCC_16) ; port SCLK
NetJ3_2: J3.2 U8.3(~{WP})
NetR43_1: R43.1 Y1.3(OUT)
NetR43_2: R43.2 U7.D10(IO_L19N_T3_VREF_16)
NetU7_B8: U7.B8(IO_L12P_T1_MRCC_16) U8.1(~{CS})
NetU7_B9: U7.B9(IO_L11N_T1_SRCC_16) U8.6(SCLK)
NetU7_C9: U7.C9(IO_L11P_T1_SRCC_16) U8.2(SO)
NetU7_D9: U7.D9(IO_L6N_T0_VREF_16) U8.5(SI)

Not connected (* = marked no-connect by the designer): U7 A8(IO_L12N_T1_MRCC_16)* A11(IO_L4N_T0_15)* A13(IO_L9P_T1_DQS_AD3P_15)* A14(IO_L9N_T1_DQS_AD3N_15)* A15(IO_L8P_T1_AD10P_15)* A16(IO_L8N_T1_AD10N_15)* A18(IO_L10N_T1_AD11N_15)* B11(IO_L4P_T0_15)* B12(IO_L3N_T0_DQS_AD1N_15)* B13(IO_L2P_T0_AD8P_15)* B14(IO_L2N_T0_AD8N_15)* B16(IO_L7P_T1_AD2P_15)* B17(IO_L7N_T1_AD2N_15)* B18(IO_L10P_T1_AD11P_15)* C12(IO_L3P_T0_DQS_AD1P_15)* C14(IO_L1N_T0_AD0N_15)* C15(IO_L12N_T1_MRCC_15)* C16(IO_L20P_T3_A20_15)* C17(IO_L20N_T3_A19_15)* D12(IO_L6P_T0_15)* D13(IO_L6N_T0_VREF_15)* D14(IO_L1P_T0_AD0P_15)* D15(IO_L12P_T1_MRCC_15)* D17(IO_L16N_T2_A27_15)* D18(IO_L21N_T3_DQS_A18_15)* E15(IO_L11P_T1_SRCC_15)* E16(IO_L11N_T1_SRCC_15)* E17(IO_L16P_T2_A28_15)* E18(IO_L21P_T3_DQS_15)* F13(IO_L5P_T0_AD9P_15)* F14(IO_L5N_T0_AD9N_15)* F15(IO_L14P_T2_SRCC_15)* F16(IO_L14N_T2_SRCC_15)* F18(IO_L22N_T3_A16_15)* G13(IO_0_15)* G14(IO_L15N_T2_DQS_ADV_B_15)* G16(IO_L13N_T2_MRCC_15)* G17(IO_L18N_T2_A23_15)* G18(IO_L22P_T3_A17_15)* H14(IO_L15P_T2_DQS_15)* H15(IO_L19N_T3_A21_VREF_15)* H16(IO_L13P_T2_MRCC_15)* H17(IO_L18P_T2_A24_15)* J13(IO_L17N_T2_A25_15)* J14(IO_L19P_T3_A22_15)* J15(IO_L24N_T3_RS0_15)* J17(IO_L23P_T3_FOE_B_15)* J18(IO_L23N_T3_FWE_B_15)* K13(IO_L17P_T2_A26_15)* K15(IO_L24P_T3_RS1_15)* K16(IO_25_15)* L14(IO_L2P_T0_D02_14)* L18(IO_L4P_T0_D04_14)* M13(IO_L6N_T0_D08_VREF_14)* M14(IO_L2N_T0_D03_14)* M16(IO_L10P_T1_D14_14)* M17(IO_L10N_T1_D15_14)* M18(IO_L4N_T0_D05_14)* N14(IO_L8P_T1_D11_14)* N15(IO_L11P_T1_SRCC_14)* N16(IO_L11N_T1_SRCC_14)* N17(IO_L9P_T1_DQS_14)* P14(IO_L8N_T1_D12_14)* P15(IO_L13P_T2_MRCC_14)* P17(IO_L12P_T1_MRCC_14)* P18(IO_L9N_T1_DQS_D13_14)* R5(IO_L19N_T3_VREF_34)* R6(IO_L19P_T3_34)* R7(IO_L23P_T3_34)* R8(IO_L24P_T3_34)* R10(IO_25_14)* R11(IO_0_14)* R12(IO_L5P_T0_D06_14)* R13(IO_L5N_T0_D07_14)* R15(IO_L13N_T2_MRCC_14)* R16(IO_L15P_T2_DQS_RDWR_B_14)* R17(IO_L12N_T1_MRCC_14)* R18(IO_L7P_T1_D09_14)* T6(IO_L23N_T3_34)* T8(IO_L24N_T3_34)* T9(IO_L24P_T3_A01_D17_14)* T10(IO_L24N_T3_A00_D16_14)* T11(IO_L19P_T3_A10_D26_14)* T13(IO_L23P_T3_A03_D19_14)* T14(IO_L14P_T2_SRCC_14)* T15(IO_L14N_T2_SRCC_14)* T16(IO_L15N_T2_DQS_DOUT_CSO_B_14)* T18(IO_L7N_T1_D10_14)* U6(IO_L22N_T3_34)* U7(IO_L22P_T3_34)* U8(IO_25_34)* U9(IO_L21P_T3_DQS_34)* U11(IO_L19N_T3_A09_D25_VREF_14)* U12(IO_L20P_T3_A08_D24_14)* U13(IO_L23N_T3_A02_D18_14)* U14(IO_L22P_T3_A05_D21_14)* U16(IO_L18P_T2_A12_D28_14)* U17(IO_L17P_T2_A14_D30_14)* U18(IO_L17N_T2_A13_D29_14)* V6(IO_L20N_T3_34)* V7(IO_L20P_T3_34)* V9(IO_L21N_T3_DQS_34)* V10(IO_L21P_T3_DQS_14)* V11(IO_L21N_T3_DQS_A06_D22_14)* V12(IO_L20N_T3_A07_D23_14)* V14(IO_L22N_T3_A04_D20_14)* V15(IO_L16P_T2_CSI_B_14)* V16(IO_L16N_T2_A15_D31_14)* V17(IO_L18N_T2_A11_D27_14)*

### Buses and harness runs
bus DRV[87..1] = port DRV[87..1]

### Notes on the sheet
- designed by
- reviewed by
- last drawn by
- Project:
- Schematic:
- last printed
- DIN-A3 L
- sheets
- of
- File:
- (in symbol C) .

### Library data of the parts
C17 = C: CAP CER 0.1UF 16V X7R 0402; 04. Manufacturer: KEMET; 07. Manufacturer  Part Number: C0402C104J4RACTU; Tolerance: ±5%; 03. Unit Price: 0.45; 13. Created Date/Name: AUG2018/Hören; Voltage Rating: 16V; Type: X7R; ComponentLink1Description: Info; ComponentLink1URL: https://www.digikey.de/product-detail/en/kemet/C0402C104J4RACTU/399-7761-6-ND/3472292; 02. Distributor Part Number: 399-7761-6-ND; 09. Operating Temperature: -55°C ~ 125°C; 11. RoHS: YES; 01. Distributor: DigiKey; ComponentLink2Description: DataSheet; ComponentLink2URL: https://content.kemet.com/datasheets/KEM_C1002_X7R_SMD.pdf; Package: 0402
J3 = Header 3Pins 100mil: CONN HEADER VERT 3POS 2.54MM; 04. Manufacturer: Samtec Inc.; 07. Manufacturer  Part Number: HMTSW-103-07-G-S-240; 03. Unit Price: 0.25; 13. Created Date/Name: AUG2018/Hören; 01. Distributor: Samtec Inc.; 02. Distributor Part Number: HMTSW-103-07-G-S-240; 11. RoHS: YES; ComponentLink1Description: Info; ComponentLink1URL: https://www.samtec.com/products/hmtsw-103-07-g-s-240; ComponentLink2Description: DataSheet; ComponentLink2URL: http://suddendocs.samtec.com/catalog_english/hmtsw.pdf
R43 = R: RES SMD 33 OHM 1% 1/16W 0402; 04. Manufacturer: Yageo; 07. Manufacturer  Part Number: RC0402FR-0733RL; 03. Unit Price: 0.09; 13. Created Date/Name: AUG2018/Hören; Power Rating: 63mW; Tolerance: ±1%; ComponentLink1URL: https://www.digikey.de/products/en?keywords=311-33.0LRDKR-ND; ComponentLink1Description: Info; 02. Distributor Part Number: 311-33.0LRDKR-ND; 09. Operating Temperature: -55°C ~ 155°C; 11. RoHS: YES; 01. Distributor: DigiKey; ComponentLink2Description: DataSheet; Type: Thick Film; Package: 0402
U7 = XC7A15T-CS324: XC7A15T-1CSG324C; MFR: XILINX; POPULATED: yes; 03. Unit Price: 20.65; MFR-PN: XC7A15T-CS324; 04. Manufacturer: XILINX; 07. Manufacturer  Part Number: XC7A15T-1CSG324C; 01. Distributor: Avnet; 02. Distributor Part Number: XC7A15T-1CSG324C; 09. Operating Temperature: 0°C ~ 85°C (TJ); 11. RoHS: YES; ComponentLink4Description: Info; ComponentLink4URL: https://www.digikey.de/products/en?keywords=XC7A15T-1CSG324C; ComponentLink5Description: DataSheet; ComponentLink5URL: https://www.xilinx.com/support/documentation/data_sheets/ds181_Artix_7_Data_Sheet.pdf; ComponentLink6Description: NXP; ComponentLink6URL: https://www.nxp.com/part/MK20DN512VMD10
U8 = MX25R3235FM1IH0: IC FLASH 32M SPI 80MHZ 8SOP; 13. Created Date/Name: AUG 2018 / Hören; ComponentLink1Description: Info; ComponentLink1URL: https://www.digikey.de/product-detail/en/macronix/MX25R3235FM1IH0/1092-1175-ND/5957736; ComponentLink2Description: DataSheet; ComponentLink2URL: https://www.macronix.com/Lists/Datasheet/Attachments/7534/MX25R3235F%2c%20Wide%20Range%2c%2032Mb%2c%20v1.6.pdf
X35 = Jumper: CONN JUMPER SHORTING .100" GOLD; 04. Manufacturer: Sullins Connector Solutions; 07. Manufacturer  Part Number: QPC02SXGN-RC; 03. Unit Price: 0.09; 13. Created Date/Name: AUG2018/Hören; 01. Distributor: DigiKey; 02. Distributor Part Number: S9337-ND; 09. Operating Temperature: -xx..+yy°C; 11. RoHS: ???; ComponentLink1Description: Info; ComponentLink1URL: https://www.digikey.de/product-detail/en/sullins-connector-solutions/QPC02SXGN-RC/S9337-ND/2618262; ComponentLink2Description: DataSheet
Y1 = ASE-25.000MHZ-LC-T: XTAL OSC XO 25.0000MHZ CMOS SMD; 04. Manufacturer: Abracon LLC; 03. Unit Price: 1.46; 13. Created Date/Name: AUG 2018 / Hören; 01. Distributor: DigiKey; 02. Distributor Part Number: 535-9568-1-ND; 07. Manufacturer  Part Number: ASE-25.000MHZ-LC-T; 11. RoHS: YES; ComponentLink1Description: Info; ComponentLink1URL: https://www.digikey.de/products/en?keywords=535-9568-1-ND; ComponentLink2Description: DataSheet; Package: 4SMD

## Sheet Input.SchDoc
size A4; DateDraw: Date Draw; DateChecked: Date Review; Workspace: Workspace; TitleTyp: Title-Typ; PageSetup: Record=PageOptions|CenterHorizontal=True|CenterVertical=True|PrintScale=0.97|XCorrection=1.00|YCorrection=1.00|PrintKind=0|BorderSize=5000000|LeftOffset=0|BottomOffset=0|Orientation=2|PaperLength=1000|PaperWidth=1000|Scale=100|PaperSource=7|PrintQuality=-3|MediaType=1|DitherType=10|PrintScaleMode=1|PaperKind=A4|PaperIndex=9
Used 5 times, as channels Controller/Input, Controller/Input, Controller/Input, Controller/Input, Controller/Input. Parts and nets are listed once, with the designators drawn on the sheet.
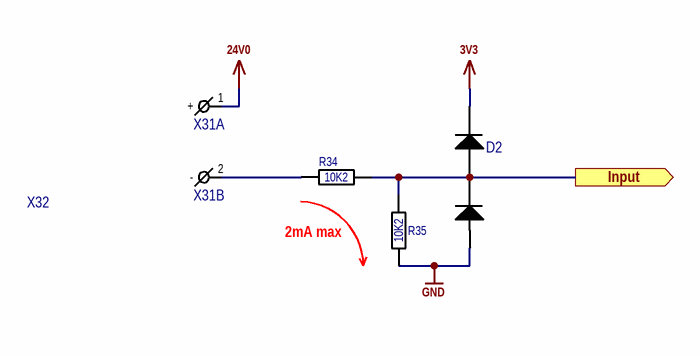
[diagram p9: Input.SchDoc]

### Parts
D2  D  [SOT23-3]  (value not drawn)
R34  value 10K2  [R0603 Reflow]  (hidden comment: R)
R35  value 10K2  [R0603 Reflow]  (hidden comment: R)
X31  X  [691322310002]  (value not drawn)  (parts A,B of 2)
X32  X  [691361300002]  (value not drawn)

### Ports
Input (out)

### Nets
3V3: D2.2(C)
24V0: X31.1(+)
GND: D2.1(A) R35.1
Input: D2.3(C/A) R34.2 R35.2 ; port Input
NetR34_1: R34.1 X31.2(-)

### Channels
Controller/Input: designators end in _Controller_Input#1; ports Input=In1
Controller/Input: designators end in _Controller_Input#2; ports Input=In2
Controller/Input: designators end in _Controller_Input#3; ports Input=In3
Controller/Input: designators end in _Controller_Input#4; ports Input=In4
Controller/Input: designators end in _Controller_Input#5; ports Input=In5

### Notes on the sheet
- 2mA max
- designed by
- reviewed by
- last drawn by
- Project:
- Schematic:
- last printed
- DIN-A4 L
- sheets
- of
- File:

### Library data of the parts
D2 = BAV199L: DIODE ARRAY GP 70V 215MA SOT23-3; 04. Manufacturer: ON Semiconductor; 07. Manufacturer  Part Number: BAV199LT1G; 03. Unit Price: 0.19; 13. Created Date/Name: AUG 2018 / Hören; 01. Distributor: DigiKey; 02. Distributor Part Number: BAV199LT1GOSDKR-ND; 09. Operating Temperature: -65°C ~ 150°C; 11. RoHS: YES; ComponentLink1Description: Info; ComponentLink1URL: https://www.digikey.de/product-detail/en/on-semiconductor/BAV199LT1G/BAV199LT1GOSDKR-ND/1831717; ComponentLink2Description: DataSheet; ComponentLink2URL: http://www.onsemi.com/pub/Collateral/BAV199LT1-D.PDF; NicName: BAV199L; Package: SOT23-3
R34 = R: RES SMD 10.2K OHM 1% 1/10W 0603; 04. Manufacturer: Yageo; 07. Manufacturer  Part Number: RC0603FR-0710K2L; 03. Unit Price: 0.09; 13. Created Date/Name: AUG2018/Hören; Power Rating: 0.1W; Tolerance: ±1%; ComponentLink1URL: *; ComponentLink1Description: Info; 02. Distributor Part Number: 311-10.2KHRDKR-ND; 09. Operating Temperature: -55°C ~ 155°C; 11. RoHS: YES; 01. Distributor: DigiKey; ComponentLink2Description: DataSheet; Type: Thick Film; Package: 0603
R35 = R: RES SMD 1.62K OHM 1% 1/10W 0603; 04. Manufacturer: Yageo; 07. Manufacturer  Part Number: RC0603FR-071K62L; 03. Unit Price: 0.09; 13. Created Date/Name: AUG2018/Hören; Power Rating: 0.1W; Tolerance: ±1%; ComponentLink1URL: *; ComponentLink1Description: Info; 02. Distributor Part Number: 311-1.62KHRDKR-ND; 09. Operating Temperature: -55°C ~ 155°C; 11. RoHS: YES; 01. Distributor: DigiKey; ComponentLink2Description: DataSheet; Type: Thick Film; Package: 0603
X31 = 691322310002: TERM BLOCK HDR 2POS 90DEG 3.81MM; 04. Manufacturer: Würth Elektronik; 03. Unit Price: 0.32; 13. Created Date/Name: ??? / Hören; System: Connector; 01. Distributor: DigiKey; 02. Distributor Part Number: 732-2088-ND; 07. Manufacturer  Part Number: 691322310002; 11. RoHS: YES; ComponentLink1Description: Info; ComponentLink1URL: https://www.digikey.de/products/en?keywords=691322310002; ComponentLink2Description: DataSheet; ComponentLink2URL: https://media.digikey.com/pdf/Data%20Sheets/Wurth%20Electronics%20PDFs/Terminal%20Blocks%20WR-TBL.pdf
X32 = 691361300002: TERM BLOCK PLUG 2POS STR 3.81MM; 13. Created Date/Name: ??? / Hören; System: Connector; ComponentLink1Description: Info; ComponentLink1URL: https://www.digikey.de/products/en?keywords=691361300002; ComponentLink2Description: DataSheet; ComponentLink2URL: https://media.digikey.com/pdf/Data%20Sheets/Wurth%20Electronics%20PDFs/Terminal%20Blocks%20WR-TBL.pdf

## Sheet Output.SchDoc
size A4; DateDraw: Date Draw; DateChecked: Date Review; Workspace: Workspace; TitleTyp: Title-Typ; PageSetup: Record=PageOptions|CenterHorizontal=True|CenterVertical=True|PrintScale=0.97|XCorrection=1.00|YCorrection=1.00|PrintKind=0|BorderSize=5000000|LeftOffset=0|BottomOffset=0|Orientation=2|PaperLength=1000|PaperWidth=1000|Scale=100|PaperSource=7|PrintQuality=-3|MediaType=1|DitherType=10|PrintScaleMode=1|PaperKind=A4|PaperIndex=9
Used 5 times, as channels Controller/Output, Controller/Output, Controller/Output, Controller/Output, Controller/Output. Parts and nets are listed once, with the designators drawn on the sheet.
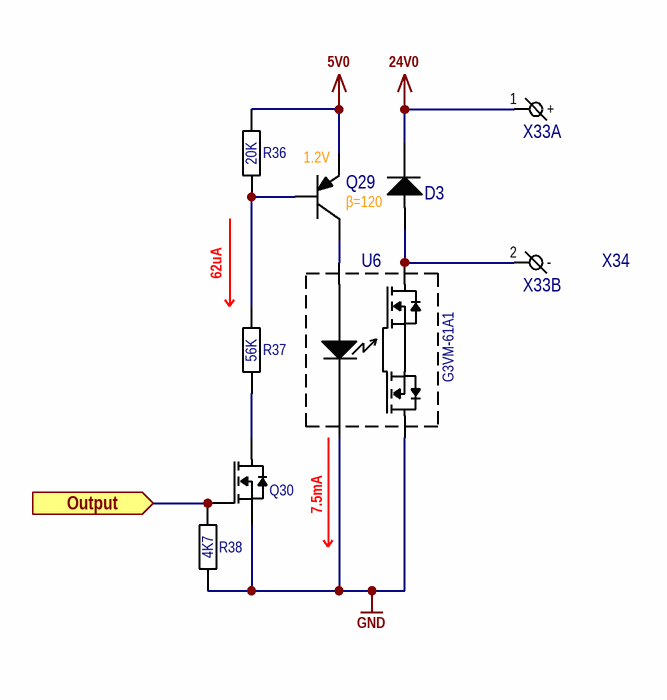
[diagram p10: Output.SchDoc]

### Parts
D3  D  [SOT23-3]  (value not drawn)
Q29  HFE: β=120  [SOT23-3]  (hidden comment: Q)
Q30  Q  [SOT23-3]  (value not drawn)
R36  value 20K  [R0201 Reflow]  (hidden comment: R)
R37  value 56K  [R0603 Reflow]  (hidden comment: R)
R38  value 4K7  [R0402 Reflow]  (hidden comment: R)
U6  U  [4DIP]  (value not drawn)
X33  X  [691322310002]  (value not drawn)  (parts A,B of 2)
X34  X  [691361300002]  (value not drawn)

### Ports
Output (in)

### Nets
5V0: Q29.2(E) R36.2
24V0: D3.3(C) X33.1(+)
GND: Q30.2(S) R38.1 U6.2(C) U6.3(D)
Output: Q30.1(G) R38.2 ; port Output
NetD3_1: D3.1(A) U6.4(D) X33.2(-)
NetQ29_1: Q29.1(B) R36.1 R37.2
NetQ29_3: Q29.3(C) U6.1(A)
NetQ30_3: Q30.3(D) R37.1

### Channels
Controller/Output: designators end in _Controller_Output#1; ports Output=DRV11
Controller/Output: designators end in _Controller_Output#2; ports Output=DRV12
Controller/Output: designators end in _Controller_Output#3; ports Output=DRV13
Controller/Output: designators end in _Controller_Output#4; ports Output=DRV14
Controller/Output: designators end in _Controller_Output#5; ports Output=DRV15

### Notes on the sheet
- (near Q29) 1.2V
- 62uA
- 7.5mA
- designed by
- reviewed by
- last drawn by
- Project:
- Schematic:
- last printed
- DIN-A4 L
- sheets
- of
- File:

### Library data of the parts
D3 = HSMS-2800-TR1G: RF DIODE SCHOTTKY 70V SOT23-3; 13. Created Date/Name: AUG 2018 / Hören; ComponentLink1Description: Info; ComponentLink1URL: https://www.digikey.de/products/en/discrete-semiconductor-products/diodes-rf/284?k=HSMS-2800&k=&pkeyword=HSMS-2800&sv=0&pv7=243&sf=0&quantity=&ColumnSort=0&page=1&pageSize=25; ComponentLink2Description: DataSheet; ComponentLink2URL: https://docs.broadcom.com/docs/AV02-0533EN
Q29 = MMSS8550-L-TP: TRANS PNP 25V 1.5A SOT-23; 04. Manufacturer: Micro Commercial Co; 03. Unit Price: 0.17; 13. Created Date/Name: AUG 2018 / Hören; 01. Distributor: DigiKey; 02. Distributor Part Number: MMSS8550-L-TPMSDKR-ND; 07. Manufacturer  Part Number: MMSS8550-L-TP; 09. Operating Temperature: -55°C ~ 150°C (TJ); 11. RoHS: YES; ComponentLink1Description: Info; ComponentLink1URL: https://www.digikey.de/product-detail/en/micro-commercial-co/MMSS8550-L-TP/MMSS8550-L-TPMSDKR-ND/2827206; ComponentLink2Description: DataSheet; ComponentLink2URL: https://www.mccsemi.com/pdf/Products/MMSS8550(SOT-23).pdf; Package: SOT23-3
Q30 = FDV303N: MOSFET N-CH 25V 680MA SOT-23; 04. Manufacturer: ON Semiconductor; 03. Unit Price: 0.41; 13. Created Date/Name: AUG 2018 / Hören; Rds On: 450 mΩ @ id=500mA & Vgs=4.5V; Vgs,th: 1.5V @ 250uA; Power Rating: 350mW; 3D-Export: No; 01. Distributor: DigiKey; 02. Distributor Part Number: FDV303NDKR-ND; 07. Manufacturer  Part Number: FDV303N; 09. Operating Temperature: -55°C ~ 150°C (TJ); 11. RoHS: YES; ComponentLink1Description: Info; ComponentLink1URL: https://www.digikey.de/product-detail/en/on-semiconductor/FDV303N/FDV303NDKR-ND/1630434; ComponentLink2Description: DataSheet; ComponentLink2URL: https://media.digikey.com/pdf/Data%20Sheets/Fairchild%20PDFs/FDV303N.pdf; Vdss: 25V; Id: 680mA
R36 = R: RES SMD 20K OHM 5% 1/10W 0603; 04. Manufacturer: Yageo; 07. Manufacturer  Part Number: RC0603JR-0720KL; 03. Unit Price: 0.09; 13. Created Date/Name: AUG2018/Hören; Power Rating: 0.1W; Tolerance: ±5%; ComponentLink1URL: *; ComponentLink1Description: Info; 02. Distributor Part Number: 311-20KGRDKR-ND; 09. Operating Temperature: -55°C ~ 155°C; 11. RoHS: YES; 01. Distributor: DigiKey; ComponentLink2Description: DataSheet; Type: Thick Film; Package: 0603
R37 = R: RES SMD 56K OHM 5% 1/10W 0603; 04. Manufacturer: Panasonic Electronic Components; 07. Manufacturer  Part Number: ERJ-3GEYJ563V; 03. Unit Price: 0.09; 13. Created Date/Name: AUG2018/Hören; Power Rating: 0.1W; Tolerance: ±5%; ComponentLink1URL: https://www.digikey.de/product-detail/en/panasonic-electronic-components/ERJ-3GEYJ563V/P56KGDKR-ND/577742; ComponentLink1Description: Info; 02. Distributor Part Number: P56KGDKR-ND; 09. Operating Temperature: -55°C ~ 155°C; 11. RoHS: YES; 01. Distributor: DigiKey; ComponentLink2Description: DataSheet; Type: Thick Film; Package: 0603
R38 = R: Resistor; Tolerance: ±1%; 13. Created Date/Name: AUG2018/Hören; ComponentLink1URL: *; ComponentLink1Description: Info; 09. Operating Temperature: -xx..+yy°C; 11. RoHS: ???; ComponentLink2Description: DataSheet; Package: *
U6 = G3VM-61A1: SSR RELAY SPST-NO 500MA 0-60V; 04. Manufacturer: Omron Electronics Inc-EMC Div; 03. Unit Price: 2.26; 13. Created Date/Name: AUG 2018 / Hören; 01. Distributor: DigiKey; 02. Distributor Part Number: Z2100-ND; 07. Manufacturer  Part Number: G3VM-61A1; 11. RoHS: YES; ComponentLink1Description: Info; ComponentLink1URL: https://www.digikey.de/products/en?keywords=G3VM-61A1; ComponentLink2Description: DataSheet; ComponentLink2URL: https://omronfs.omron.com/en_US/ecb/products/pdf/en-g3vm_61a1_d1.pdf; NicName: G3VM-61A1; Package: 4DIP
X33 = 691322310002: as X31 on sheet Input; 01. Distributor: DigiKey; 02. Distributor Part Number: 732-2088-ND; 07. Manufacturer  Part Number: 691322310002; 11. RoHS: YES; ComponentLink1Description: Info; ComponentLink1URL: https://www.digikey.de/products/en?keywords=691322310002; ComponentLink2Description: DataSheet; ComponentLink2URL: https://media.digikey.com/pdf/Data%20Sheets/Wurth%20Electronics%20PDFs/Terminal%20Blocks%20WR-TBL.pdf
X34 = 691361300002: as X32 on sheet Input; ComponentLink1Description: Info; ComponentLink1URL: https://www.digikey.de/products/en?keywords=691361300002; ComponentLink2Description: DataSheet; ComponentLink2URL: https://media.digikey.com/pdf/Data%20Sheets/Wurth%20Electronics%20PDFs/Terminal%20Blocks%20WR-TBL.pdf